# Altium project RadiationDetector.PrjPcb (part 4 of 5)

## Sheet Geiger_Circuit.SchDoc
size A4; CheckedBy: Sr. Andrés Roldán; Address1: Avda. Madrid 28, Edif. I+D Josefina Castro Vizoso,  2ª planta 18012 - GRANADA, SPAIN; SheetNumber: 6; SheetTotal: 6
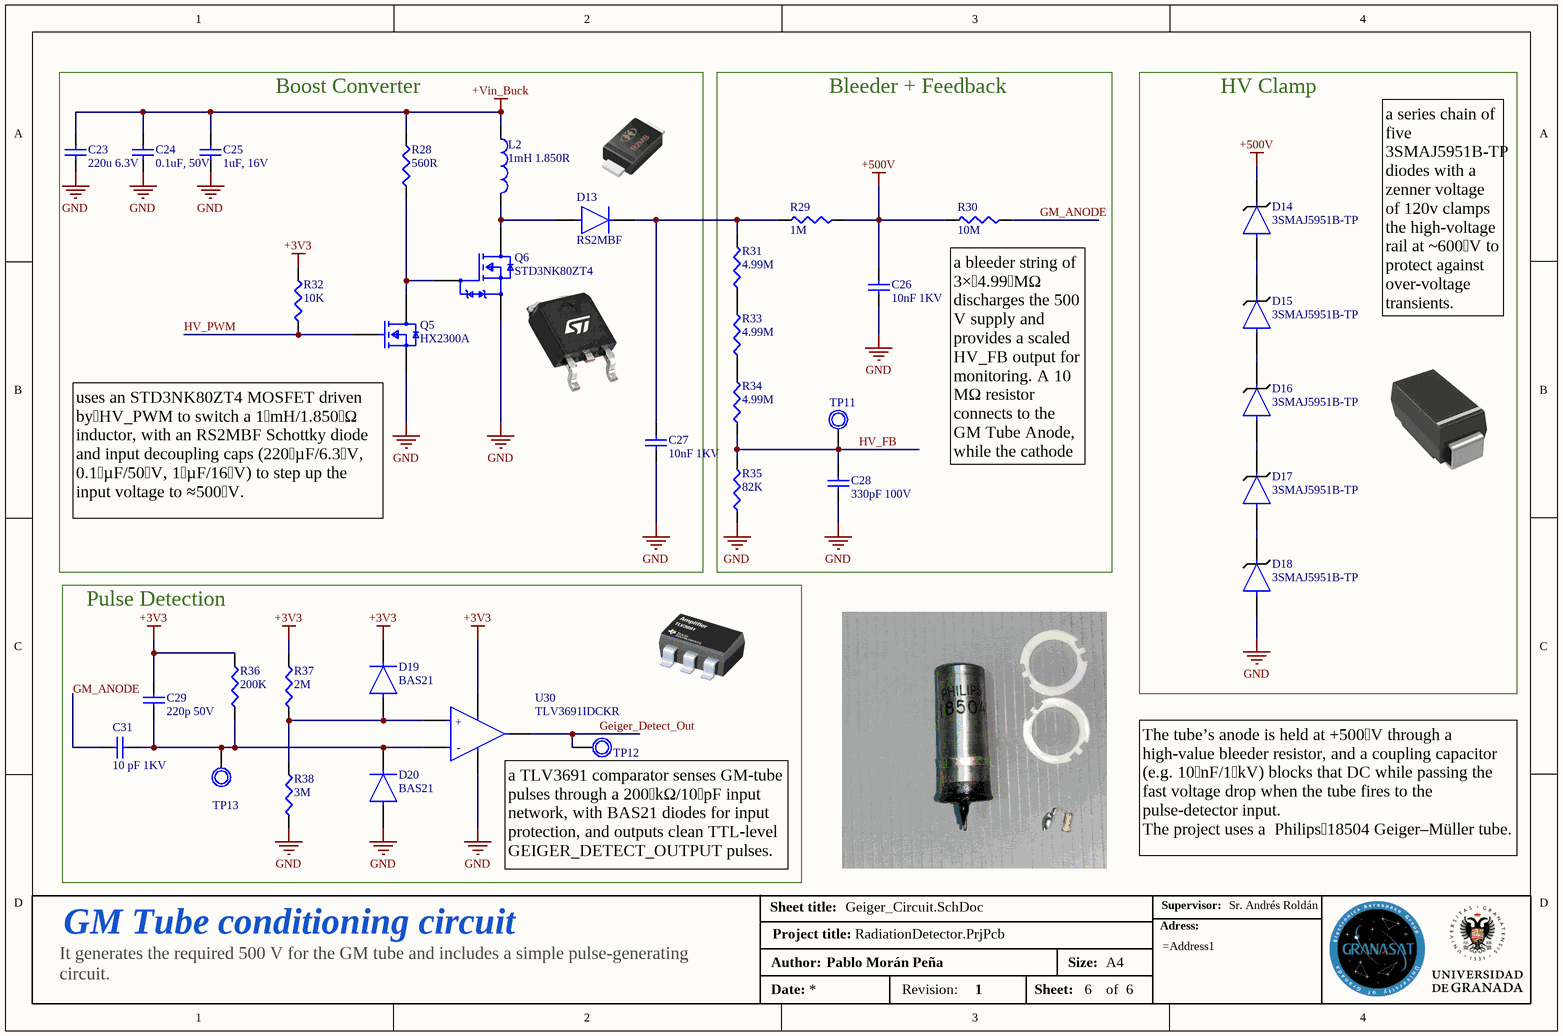
[diagram p5: Geiger_Circuit.SchDoc]

### Parts
C23  220u 6.3V  [ANTC3225X280N]
C24  0.1uF, 50V  [CAP 0402_1005]
C25  1uF, 16V  [CAP 0402_1005]
C26  10nF 1KV  [CAP 1206_3216 - 1.2MM]
C27  10nF 1KV  [CAP 1206_3216 - 1.2MM]
C28  330pF 100V  [CAPC2012X94N]
C29  220p 50V  [CAP 0402_1005]
C31  10 pF 1KV  [CAP 1206_3216 - 1.2MM]
D13  RS2MBF  [RS2MBF]
D14  3SMAJ5951B-TP  [DIOM4325X244N]
D15  3SMAJ5951B-TP  [DIOM4325X244N]
D16  3SMAJ5951B-TP  [DIOM4325X244N]
D17  3SMAJ5951B-TP  [DIOM4325X244N]
D18  3SMAJ5951B-TP  [DIOM4325X244N]
D19  BAS21  [SOT-23]
D20  BAS21  [SOT-23]
L2  1mH 1.850R  [48102SC]
Q5  HX2300A  [SOT-23]
Q6  STD3NK80ZT4  [DPAK_STM]
R28  560R  [RESC1005X37N]
R29  1M  [RESC1005X37N]
R30  10M  [RESC1005X37N]
R31  4.99M  [RESC3116X65N]
R32  10K  [RESC1005X37N]
R33  4.99M  [RESC3116X65N]
R34  4.99M  [RESC3116X65N]
R35  82K  [RESC1005X37N]
R36  200K  [RESC1005X37N]
R37  2M  [RESC1005X37N]
R38  3M  [RESC1005X37N]
TP11  Testpoint  [Testpoint]  (value not drawn)  (no BOM)
TP12  Testpoint  [Testpoint]  (value not drawn)  (no BOM)
TP13  Testpoint  [Testpoint]  (value not drawn)  (no BOM)
U30  TLV3691IDCKR  [FP-DCK0005A-IPC_B]

### Blocks framed on the sheet
Boost Converter: C23-C25 C27 D13 L2 Q5 Q6 R28 R32
Bleeder + Feedback: C26 C28 R29-R31 R33-R35 TP11
HV Clamp: D14-D18
Pulse Detection: C29 C31 D19 D20 R36-R38 TP12 TP13 U30

### Nets
+3V3: C29.2 D19.3(C) R32.2 R36.2 R37.1 U30.5(VCC)
+500V: C26.2 D14.1(C) R29.2 R30.1
+Vin_Buck: C23.2 C24.2 C25.2 L2.1 R28.2
GND: C23.1 C24.1 C25.1 C26.1 C27.1 C28.1 D18.2(A) D20.1(A) Q5.2(S) Q6.3(Source) R35.1 R38.1 U30.2(GND)
Geiger_Detect_Out: TP12.1 U30.4(OUT)
GM_ANODE: C31.1 R30.2
HV_FB: C28.2 R34.2 R35.2 TP11.1
HV_PWM: Q5.1(G) R32.1
NetC27_2: C27.2 D13.1(C) R29.1 R31.1
NetC29_1: C29.1 C31.2 D20.3(C) R36.1 TP13.1 U30.3(IN-)
NetD13_2: D13.2(A) L2.2 Q6.2(Drain)
NetD14_2: D14.2(A) D15.1(C)
NetD15_2: D15.2(A) D16.1(C)
NetD16_2: D16.2(A) D17.1(C)
NetD17_2: D17.2(A) D18.1(C)
NetD19_1: D19.1(A) R37.2 R38.2 U30.1(IN+)
NetQ5_3: Q5.3(D) Q6.1(Gate) R28.1
NetR31_2: R31.2 R33.1
NetR33_2: R33.2 R34.1

### Notes on the sheet
- a series chain of five 3SMAJ5951B-TP diodes with a zenner voltage of 120v clamps the high‑voltage rail at ~600 V to protect against over‑voltage transients.
- (near Q5) uses an STD3NK80ZT4 MOSFET driven by HV_PWM to switch a 1 mH/1.850 Ω inductor, with an RS2MBF Schottky diode and input decoupling caps (220 µF/6.3 V, 0.1 µF/50 V, 1 µF/16 V) to step up the input voltage to ≈500 V.
- (near R30) a bleeder string of 3× 4.99 MΩ discharges the 500 V supply and provides a scaled HV_FB output for monitoring. A 10 MΩ resistor connects to the GM Tube Anode, while the cathode is connected to GND
- The tube’s anode is held at +500 V through a high‑value bleeder resistor, and a coupling capacitor (e.g. 10 nF/1 kV) blocks that DC while passing the fast voltage drop when the tube fires to the pulse‑detector input.
  The project uses a  Philips 18504 Geiger–Müller tube.
- a TLV3691 comparator senses GM‑tube pulses through a 200 kΩ/10 pF input network, with BAS21 diodes for input protection, and outputs clean TTL‑level GEIGER_DETECT_OUTPUT pulses.
- Sheet title:
- Supervisor:
- GM Tube conditioning circuit
- Author:
- Project title:
- Size:
- A4
- Adress:
- It generates the required 500 V for the GM tube and includes a simple pulse-generating circuit.
- Date:
- Revision:
- Sheet:
- of
- (in symbol TLV3691IDCKR) +; -

### Library data of the parts
C23 = CL32A227MQVNNNE: CAP CER 220UF 6.3V X5R 1210; Manufacturer: Samsung; Dielectric Material: Ceramic; Multilayer: Yes; Tolerance  (fill in as +-): 20%; Supplier: Digikey; Supplier Part Number: 1276-3375-6-ND; Manufacturer Part Number: CL32A227MQVNNNE; RoHS: Yes; Category: Ceramic Capacitors; Stock: 100920; Pricing: 1=1,9, 10=1,278, 100=0,9548 (USD); Mounting Technology: Surface Mount; Pins: 2; Package Shape: Rectangular; Terminal Finish: Nickel; Case/Package: 1210; Min Operating Temperature: -55°C; Max Operating Temperature: 85°C; JESD-609 Code: e3; Package Style: SMTMeter; Value: 220uF; Capacitor Type: Ceramic; Packaging: Tape and Reel; Tolerance (fill in as +-): 20%; Rated DC Voltage (URdc): 6.3V; Temperature Characteristics Code: X5R; Termination: Wraparound; Length: 3.2mm; Width: 2.5mm; Height: 2.8mm; Reach SVHC Compliant: Yes; RoHS Compliant: Yes; ComponentLink1URL: https://datasheet.ciiva.com:443/pdfs/VipMasterIC/IC/SEMS/SEMS-S-A0008525088/SEMS-S-A0008525201-1.pdf?src-supplier=IHS+Markit; ComponentLink1Description: https://datasheet.ciiva.com:443/pdfs/VipMasterIC/IC/SEMS/SEMS-S-A0008525088/SEMS-S-A0008525201-1.pdf?src-supplier=IHS+Markit; ComponentLink2URL: https://datasheet.ciiva.com/25722/cl32a227mqvnnne-25722912.pdf?src-supplier=Digikey; ComponentLink2Description: https://datasheet.ciiva.com/25722/cl32a227mqvnnne-25722912.pdf?src-supplier=Digikey; LCSC Part Number: C400951
C24 = CL05B104KB5NNNC: CAP CER 0.1UF 50V X7R 0402; Manufacturer: Samsung; Dielectric Material: Ceramic; Value: 100nF; Multilayer: Yes; Tolerance  (fill in as +-): 10%; Supplier: Avnet; Supplier Part Number: CL05B104KB5NNNC; Manufacturer Part Number: CL05B104KB5NNNC; RoHS: Yes; Category: Ceramic Capacitors; Pricing: 100000=0,00598, 120000=0,00595, 220000=0,00592, 500000=0,00589, 1000000=0,00586 (USD); Mounting Technology: Surface Mount; Pins: 2; Package Shape: Rectangular; Case/Package: 0402; Terminal Finish: Nickel; Min Operating Temperature: -55°C; Max Operating Temperature: 125°C; JESD-609 Code: e3; Capacitor Type: Ceramic; Packaging: Tape and Reel; Tolerance (fill in as +-): 10%; Rated DC Voltage (URdc): 50V; Temperature Characteristics Code: X7R; Termination: Wraparound; Reach SVHC Compliant: Yes; RoHS Compliant: Yes; ComponentLink1URL: https://datasheet.ciiva.com:443/pdfs/VipMasterIC/IC/SEMS/SEMS-S-A0008523115/SEMS-S-A0008523176-1.pdf?src-supplier=IHS+Markit; ComponentLink1Description: https://datasheet.ciiva.com:443/pdfs/VipMasterIC/IC/SEMS/SEMS-S-A0008523115/SEMS-S-A0008523176-1.pdf?src-supplier=IHS+Markit; ComponentLink2URL: https://datasheet.octopart.com/CL05B104KB5NNNC-Samsung-datasheet-97040617.pdf?src-supplier=Future+Electronics; ComponentLink2Description: https://datasheet.octopart.com/CL05B104KB5NNNC-Samsung-datasheet-97040617.pdf?src-supplier=Future+Electronics; ComponentLink3URL: https://datasheet.octopart.com/CL05B104KB5NNNC-Samsung-datasheet-8326407.pdf?src-supplier=TME; ComponentLink3Description: https://datasheet.octopart.com/CL05B104KB5NNNC-Samsung-datasheet-8326407.pdf?src-supplier=TME; LCSC Part Number: C960916
C25 = CL05A105KO5NNNC: CAP CER 1UF 16V X5R 0402; Manufacturer: Samsung Electro-Mechanics; Dielectric Material: Ceramic; Multilayer: Yes; Tolerance  (fill in as +-): 10%; Supplier: Digikey; Supplier Part Number: 1276-1067-1-ND; Manufacturer Part Number: CL05A105KO5NNNC; Category: Ceramic Capacitors; Stock: 655135; Pricing: 1=0,08, 10=0,014, 100=0,0104, 1000=0,0072, 2500=0,0064 (USD); Mounting Technology: Surface Mount; Pins: 2; Package Shape: Rectangular; Case/Package: 0402; Terminal Finish: Nickel; Min Operating Temperature: -55°C; Max Operating Temperature: 85°C; JESD-609 Code: e3; Value: 1uF; Capacitor Type: Ceramic; Package Style: SMTMeter; Packaging: Tape and Reel; Tolerance (fill in as +-): 10%; Rated DC Voltage (URdc): 16V; Temperature Characteristics Code: X5R; Termination: Wraparound; Length: 1mm; Width: 0.5mm; Height: 0.55mm; Reach SVHC Compliant: Yes; RoHS Compliant: Yes; ComponentLink1URL: https://datasheet.ciiva.com:443/pdfs/VipMasterIC/IC/SEMS/SEMS-S-A0008384515/SEMS-S-A0008892675-1.pdf?src-supplier=IHS+Markit; ComponentLink1Description: https://datasheet.ciiva.com:443/pdfs/VipMasterIC/IC/SEMS/SEMS-S-A0008384515/SEMS-S-A0008892675-1.pdf?src-supplier=IHS+Markit; ComponentLink2URL: https://datasheet.octopart.com/CL05A105KO5NNNC-Samsung-Electro-Mechanics-datasheet-181960514.pdf?src-supplier=Farnell; ComponentLink2Description: https://datasheet.octopart.com/CL05A105KO5NNNC-Samsung-Electro-Mechanics-datasheet-181960514.pdf?src-supplier=Farnell; ComponentLink3URL: https://datasheet.octopart.com/CL05A105KO5NNNC-Samsung-Electro-Mechanics-datasheet-136031720.pdf?src-supplier=Samsung+SCT; ComponentLink3Description: https://datasheet.octopart.com/CL05A105KO5NNNC-Samsung-Electro-Mechanics-datasheet-136031720.pdf?src-supplier=Samsung+SCT; ComponentLink4URL: https://datasheet.octopart.com/CL05A105KO5NNNC-Samsung-Electro-Mechanics-datasheet-110226202.pdf?src-supplier=Future+Electronics; ComponentLink4Description: https://datasheet.octopart.com/CL05A105KO5NNNC-Samsung-Electro-Mechanics-datasheet-110226202.pdf?src-supplier=Future+Electronics; ComponentLink5URL: https://datasheet.octopart.com/CL05A105KO5NNNC-Samsung-Electro-Mechanics-datasheet-81461590.pdf?src-supplier=Future+Electronics; ComponentLink5Description: https://datasheet.octopart.com/CL05A105KO5NNNC-Samsung-Electro-Mechanics-datasheet-81461590.pdf?src-supplier=Future+Electronics; ComponentLink6URL: https://datasheet.octopart.com/CL05A105KO5NNNC-Samsung-Electro-Mechanics-datasheet-149136633.pdf?src-supplier=Future+Electronics; ComponentLink6Description: https://datasheet.octopart.com/CL05A105KO5NNNC-Samsung-Electro-Mechanics-datasheet-149136633.pdf?src-supplier=Future+Electronics; ComponentLink7URL: https://datasheet.octopart.com/CL05A105KO5NNNC-Samsung-Electro-Mechanics-datasheet-97040617.pdf; ComponentLink7Description: https://datasheet.octopart.com/CL05A105KO5NNNC-Samsung-Electro-Mechanics-datasheet-97040617.pdf; ComponentLink8URL: https://datasheet.octopart.com/CL05A105KO5NNNC-Samsung-Electro-Mechanics-datasheet-8324245.pdf; ComponentLink8Description: https://datasheet.octopart.com/CL05A105KO5NNNC-Samsung-Electro-Mechanics-datasheet-8324245.pdf; ComponentLink9URL: https://datasheet.octopart.com/General-Multilayer-Ceramic-Capacitors-Samsung-datasheet-family-111.pdf; ComponentLink9Description: https://datasheet.octopart.com/General-Multilayer-Ceramic-Capacitors-Samsung-datasheet-family-111.pdf; ComponentLink10URL: https://datasheet.octopart.com/CL05A105KO5NNNC-Samsung-Electro-Mechanics-datasheet-11776774.pdf?src-supplier=Arrow+Electronics; ComponentLink10Description: https://datasheet.octopart.com/CL05A105KO5NNNC-Samsung-Electro-Mechanics-datasheet-11776774.pdf?src-supplier=Arrow+Electronics; ComponentLink11URL: https://datasheet.octopart.com/CL05A105KO5NNNC-Samsung-datasheet-97040617.pdf; ComponentLink11Description: https://datasheet.octopart.com/CL05A105KO5NNNC-Samsung-datasheet-97040617.pdf; ComponentLink12URL: https://datasheet.octopart.com/CL05A105KO5NNNC-Samsung-datasheet-8324245.pdf; ComponentLink12Description: https://datasheet.octopart.com/CL05A105KO5NNNC-Samsung-datasheet-8324245.pdf; ComponentLink13URL: https://datasheet.octopart.com/CL05A105KO5NNNC-Samsung-datasheet-42280519.pdf?src-supplier=Future+Electronics; ComponentLink13Description: https://datasheet.octopart.com/CL05A105KO5NNNC-Samsung-datasheet-42280519.pdf?src-supplier=Future+Electronics; ComponentLink14URL: https://datasheet.octopart.com/CL05A105KO5NNNC-Samsung-datasheet-34152987.pdf?src-supplier=Future+Electronics; ComponentLink14Description: https://datasheet.octopart.com/CL05A105KO5NNNC-Samsung-datasheet-34152987.pdf?src-supplier=Future+Electronics; ComponentLink15URL: https://datasheet.octopart.com/CL05A105KO5NNNC-Samsung-datasheet-11776774.pdf?src-supplier=Future+Electronics; ComponentLink15Description: https://datasheet.octopart.com/CL05A105KO5NNNC-Samsung-datasheet-11776774.pdf?src-supplier=Future+Electronics; ComponentLink16URL: https://datasheet.octopart.com/CL05A105KO5NNNC-Samsung-datasheet-8329584.pdf?src-supplier=Future+Electronics; ComponentLink16Description: https://datasheet.octopart.com/CL05A105KO5NNNC-Samsung-datasheet-8329584.pdf?src-supplier=Future+Electronics; ComponentLink17URL: https://datasheet.octopart.com/CL05A105KO5NNNC-Samsung-datasheet-59220082.pdf?src-supplier=TME; ComponentLink17Description: https://datasheet.octopart.com/CL05A105KO5NNNC-Samsung-datasheet-59220082.pdf?src-supplier=TME; LCSC Part Number: C29266
C26 C27 = CC1206KKX7RCBB103: CAP CER 10000PF 1KV X7R 1206; Manufacturer: Yageo; Dielectric Material: Ceramic; Multilayer: Yes; Tolerance  (fill in as +-): 10%; Supplier: Digikey; Supplier Part Number: 311-1500-1-ND; Manufacturer Part Number: CC1206KKX7RCBB103; RoHS: Yes; Category: Ceramic Capacitors; Stock: 52303; Pricing: 1=0,54, 10=0,329, 100=0,2222, 1000=0,16703 (USD); Mounting Technology: Surface Mount; Pins: 2; Package Shape: Rectangular; Case/Package: 1206; Terminal Finish: Nickel; Min Operating Temperature: -55°C; Max Operating Temperature: 125°C; JESD-609 Code: e3; Value: 10nF; Capacitor Type: Ceramic; Package Style: SMTMeter; Packaging: Tape and Reel; Tolerance (fill in as +-): 10%; Rated DC Voltage (URdc): 1kV; Temperature Characteristics Code: X7R; Termination: Wraparound; Length: 3.2mm; Width: 1.6mm; Height: 1.25mm; Reach SVHC Compliant: Yes; RoHS Compliant: Yes; ComponentLink1URL: https://datasheet.ciiva.com:443/pdfs/VipMasterIC/IC/YAGO/YAGO-S-A0000113014/YAGO-S-A0000113014-1.pdf?src-supplier=IHS+Markit; ComponentLink1Description: https://datasheet.ciiva.com:443/pdfs/VipMasterIC/IC/YAGO/YAGO-S-A0000113014/YAGO-S-A0000113014-1.pdf?src-supplier=IHS+Markit; ComponentLink2URL: https://datasheet.ciiva.com/11788/0900766b80d8503a-11788379.pdf?src-supplier=Rs; ComponentLink2Description: https://datasheet.ciiva.com/11788/0900766b80d8503a-11788379.pdf?src-supplier=Rs; ComponentLink3URL: https://datasheet.ciiva.com/26863/getdatasheetpartid-403810-26863103.pdf?src-supplier=Verical; ComponentLink3Description: https://datasheet.ciiva.com/26863/getdatasheetpartid-403810-26863103.pdf?src-supplier=Verical; ComponentLink4URL: https://datasheet.ciiva.com/15381/upy-gp-np0-16v-to-50v-8-15381925.pdf?src-supplier=Mouser; ComponentLink4Description: https://datasheet.ciiva.com/15381/upy-gp-np0-16v-to-50v-8-15381925.pdf?src-supplier=Mouser; LCSC Part Number: C107192
C28 = CC0805JRNPO0BN331: CAP CER 330PF 100V C0G/NPO 0805; Manufacturer: Yageo; Dielectric Material: Ceramic; Multilayer: Yes; Tolerance  (fill in as +-): 5%; Temperature Characteristics Code: C0G; Supplier: Digikey; Supplier Part Number: 311-3287-1-ND; Manufacturer Part Number: CC0805JRNPO0BN331; RoHS: Yes; Category: Ceramic Capacitors; Stock: 1000; Pricing: 1=0,13, 10=0,071, 100=0,0428, 1000=0,02846 (USD); Mounting Technology: Surface Mount; Pins: 2; Package Shape: Rectangular; Case/Package: 0805; Terminal Finish: Nickel; Min Operating Temperature: -55°C; Max Operating Temperature: 125°C; JESD-609 Code: e3; Value: 330pF; Capacitor Type: Ceramic; Package Style: SMTMeter; Packaging: Tape and Reel; Tolerance (fill in as +-): 5%; Rated DC Voltage (URdc): 100V; Termination: Wraparound; Length: 2mm; Width: 1.25mm; Height: 0.6mm; RoHS Compliant: Yes; Reach SVHC Compliant: Yes; ComponentLink1URL: https://datasheet.ciiva.com:443/pdfs/VipMasterIC/IC/YAGO/YAGO-S-A0003556389/YAGO-S-A0003556389-1.pdf?src-supplier=IHS+Markit; ComponentLink1Description: https://datasheet.ciiva.com:443/pdfs/VipMasterIC/IC/YAGO/YAGO-S-A0003556389/YAGO-S-A0003556389-1.pdf?src-supplier=IHS+Markit; ComponentLink2URL: https://datasheet.ciiva.com/26862/getdatasheetpartid-486993-26862927.pdf?src-supplier=Verical; ComponentLink2Description: https://datasheet.ciiva.com/26862/getdatasheetpartid-486993-26862927.pdf?src-supplier=Verical; ComponentLink3URL: https://datasheet.ciiva.com/177/mlccorderingcode-177835.pdf?src-supplier=Digikey; ComponentLink3Description: https://datasheet.ciiva.com/177/mlccorderingcode-177835.pdf?src-supplier=Digikey; ComponentLink4URL: https://datasheet.ciiva.com/11586/upy-np0x7r-mv-100-to-630v-9-11586191.pdf?src-supplier=Avnet; ComponentLink4Description: https://datasheet.ciiva.com/11586/upy-np0x7r-mv-100-to-630v-9-11586191.pdf?src-supplier=Avnet; ComponentLink5URL: https://datasheet.ciiva.com/17206/upy-np0x7r-mv-100-to-630v-9-17206229.pdf?src-supplier=Future+Electronics; ComponentLink5Description: https://datasheet.ciiva.com/17206/upy-np0x7r-mv-100-to-630v-9-17206229.pdf?src-supplier=Future+Electronics; LCSC Part Number: C113820
C29 = CL05B221KB5NNNC: CAP CER 220PF 50V X7R 0402; Manufacturer: Samsung; Dielectric Material: Ceramic; Multilayer: Yes; Tolerance  (fill in as +-): 10%; Supplier: Digikey; Supplier Part Number: 1276-1531-1-ND; Manufacturer Part Number: CL05B221KB5NNNC; RoHS: Yes; Category: Ceramic Capacitors; Stock: 59270; Pricing: 1=0,1, 10=0,019, 100=0,0104, 1000=0,00621, 2500=0,00466, 5000=0,00442 (USD); Mounting Technology: Surface Mount; Pins: 2; Package Shape: Rectangular; Case/Package: 0402; Terminal Finish: Nickel; Min Operating Temperature: -55°C; Max Operating Temperature: 125°C; JESD-609 Code: e3; Value: 220pF; Capacitor Type: Ceramic; Package Style: SMTMeter; Packaging: Tape and Reel; Tolerance (fill in as +-): 10%; Rated DC Voltage (URdc): 50V; Temperature Characteristics Code: X7R; Termination: Wraparound; Length: 1mm; Width: 0.5mm; Height: 0.55mm; Reach SVHC Compliant: Yes; RoHS Compliant: Yes; ComponentLink1URL: https://datasheet.ciiva.com:443/pdfs/VipMasterIC/IC/SEMS/SEMS-S-A0008384515/SEMS-S-A0008872887-1.pdf?src-supplier=IHS+Markit; ComponentLink1Description: https://datasheet.ciiva.com:443/pdfs/VipMasterIC/IC/SEMS/SEMS-S-A0008384515/SEMS-S-A0008872887-1.pdf?src-supplier=IHS+Markit; ComponentLink2URL: https://datasheet.ciiva.com/25806/cl05b221kb5nnnc-25806724.pdf?src-supplier=Digikey; ComponentLink2Description: https://datasheet.ciiva.com/25806/cl05b221kb5nnnc-25806724.pdf?src-supplier=Digikey; ComponentLink3URL: https://datasheet.ciiva.com/26838/getdatasheetpartid-359684-26838219.pdf?src-supplier=Verical; ComponentLink3Description: https://datasheet.ciiva.com/26838/getdatasheetpartid-359684-26838219.pdf?src-supplier=Verical; ComponentLink4URL: https://datasheet.ciiva.com/16449/cl05b221kb5nnnc-16449133.pdf?src-supplier=Future+Electronics; ComponentLink4Description: https://datasheet.ciiva.com/16449/cl05b221kb5nnnc-16449133.pdf?src-supplier=Future+Electronics; ComponentLink5URL: https://datasheet.ciiva.com/26309/mlcc-catalogdownload2013-eng-26309018.pdf?src-supplier=Distrelec; ComponentLink5Description: https://datasheet.ciiva.com/26309/mlcc-catalogdownload2013-eng-26309018.pdf?src-supplier=Distrelec; LCSC Part Number: C296710
C31 = CC1206JKNPOCBN100: CAP CER 10PF 1KV C0G/NPO 1206; Manufacturer: Yageo; Dielectric Material: Ceramic; Multilayer: Yes; Tolerance  (fill in as +-): 5%; Temperature Characteristics Code: NP0; Supplier: Digikey; Supplier Part Number: 311-1912-6-ND; Manufacturer Part Number: CC1206JKNPOCBN100; RoHS: Yes; Category: Ceramic Capacitors; Stock: 6057; Pricing: 1=0,22, 10=0,129, 100=0,0815, 1000=0,05691 (USD); Pins: 2; Case/Package: 1206; Terminal Finish: Nickel; Min Operating Temperature: -55°C; Max Operating Temperature: 125°C; JESD-609 Code: e3; Value: 10pF; Capacitor Type: Ceramic; Package Style: SMTMeter; Packaging: Tape and Reel; Tolerance (fill in as +-): 5%; Rated DC Voltage (URdc): 1kV; Series: SIZE(HIGH-VOLTAGE); Length: 3.2mm; Width: 1.6mm; Height: 1.25mm; Reach SVHC Compliant: Yes; RoHS Compliant: Yes; ComponentLink1URL: https://datasheet.ciiva.com:443/pdfs/VipMasterIC/IC/YAGO/YAGO-S-A0000113014/YAGO-S-A0000113014-1.pdf?src-supplier=IHS+Markit; ComponentLink1Description: https://datasheet.ciiva.com:443/pdfs/VipMasterIC/IC/YAGO/YAGO-S-A0000113014/YAGO-S-A0000113014-1.pdf?src-supplier=IHS+Markit; ComponentLink2URL: https://datasheet.ciiva.com/11494/hv-11494856.pdf?src-supplier=Avnet; ComponentLink2Description: https://datasheet.ciiva.com/11494/hv-11494856.pdf?src-supplier=Avnet; LCSC Part Number: C107172
D13 = RS2MBF: 2A 1000V 1.3V SMB-FL Diodes - General Purpose ROHS; LCSC Part Number: C5271853
D14-D18 = 3SMAJ5951B-TP: DIODE ZENER 120V 3W DO214AC; Manufacturer: MCC; Diode Element Material: SILICON; Package Body Material: Plastic; Polarity: Unidirectional; Dynamic Impedance-Max: 380R; Number of Elements: 1; Time @ Peak Reflow Temperature-Max (s): 10s; Voltage Tol-Max: 5%; Test Current: 3.1mA; JEDEC-95 Code: DO-214AC; Supplier: Digikey; Supplier Part Number: 3SMAJ5951B-TPMSCT-ND; Manufacturer Part Number: 3SMAJ5951B-TP; RoHS: Yes; Category: Zener Diodes; Stock: 10918; Pricing: 1=0,42, 10=0,259, 100=0,1637, 500=0,12212, 1000=0,098, 2000=0,09734 (USD); Pins: 2; Package Shape: Rectangular; Terminal Finish: Tin; Min Operating Temperature: -55°C; Max Operating Temperature: 150°C; JESD-609 Code: e3; Diode Type: ZENER; JESD-30 Code: R-PDSO-C2; Moisture Sensitivity Level: 1; Package Style: SMALL OUTLINEMeter; Peak Reflow Temperature (Cel): 260°C; Max Power Dissipation: 3W; Reference Voltage-Nom: 120V; Surface Mount: Yes; Technology: ZENER; Terminal Form: C BEND; Terminal Position: DUAL; Reach SVHC Compliant: No; RoHS Compliant: Yes; ComponentLink1URL: https://datasheet.ciiva.com:443/pdfs/VipMasterIC/IC/MCCC/MCCC-S-A0009752199/MCCC-S-A0009752199-1.pdf?src-supplier=IHS+Markit; ComponentLink1Description: https://datasheet.ciiva.com:443/pdfs/VipMasterIC/IC/MCCC/MCCC-S-A0009752199/MCCC-S-A0009752199-1.pdf?src-supplier=IHS+Markit; ComponentLink2URL: https://datasheet.ciiva.com/6389/3smaj5913b3smaj5956bdo-214ac-6389957.pdf?src-supplier=Digikey; ComponentLink2Description: https://datasheet.ciiva.com/6389/3smaj5913b3smaj5956bdo-214ac-6389957.pdf?src-supplier=Digikey; LCSC Part Number: C511105
D19 D20 = BAS21: DIODE STANDARD 250V 200MA SOT233; Manufacturer: onsemi; Diode Type: RECTIFIER; Forward Voltage: 1V; Number of Elements: 1; Rep Pk Reverse Voltage-Max: 200V; Reverse Recovery Time-Max: 0.05us; Supplier: Farnell; Supplier Part Number: 9843728; Manufacturer Part Number: BAS21; RoHS: Yes; Pricing: 5=0,185, 25=0,136, 100=0,0803, 250=0,0677, 500=0,0551, 1000=0,0425, 5000=0,023 (GBP); Terminal Finish: Tin; Max Operating Temperature: 175°C; JESD-609 Code: e0; Max Output current: 200mA; Surface Mount: Yes; RoHS Compliant: No; ComponentLink1URL: https://datasheet.ciiva.com/1179/82312-1179824.pdf?src-supplier=Element14; ComponentLink1Description: https://datasheet.ciiva.com/1179/82312-1179824.pdf?src-supplier=Element14; ComponentLink2URL: https://datasheet.ciiva.com/1179/82312-1179825.pdf?src-supplier=Element14; ComponentLink2Description: https://datasheet.ciiva.com/1179/82312-1179825.pdf?src-supplier=Element14; LCSC Part Number: C8661
L2 = 48102SC: FIXED IND 1MH 520MA 1.85 OHM SMD; Manufacturer: Murata; Tolerance: 20%; DC Resistance (DCR): 1.85R; Inductance-Nom (L): 1000uH; Inductor Application: POWER INDUCTOR; Inductor Type: GENERAL PURPOSE INDUCTOR; Channels: 1; Self Resonant Frequency: 4MHz; Shape/Size Description: RECTANGULAR PACKAGE; Shielding: Shielded; Test Frequency: 10kHz; Supplier: Digikey; Supplier Part Number: 811-3598-1-ND; Manufacturer Part Number: 48102SC; RoHS: Yes; Category: Fixed Inductors; Stock: 1140; Pricing: 1=0,52 (USD); Pins: 2; Terminal Finish: Tin; Min Operating Temperature: -40°C; Max Operating Temperature: 85°C; JESD-609 Code: e3; Surface Mount: Yes; Terminal Placement: Dual Ended; Termination: One Surface; Reach SVHC Compliant: Yes; RoHS Compliant: Yes; ComponentLink1URL: https://datasheet.ciiva.com:443/pdfs/VipMasterIC/IC/MUPS/MUPS-S-A0002835574/MUPS-S-A0002835574-1.pdf?src-supplier=IHS+Markit; ComponentLink1Description: https://datasheet.ciiva.com:443/pdfs/VipMasterIC/IC/MUPS/MUPS-S-A0002835574/MUPS-S-A0002835574-1.pdf?src-supplier=IHS+Markit; ComponentLink2URL: https://datasheet.ciiva.com/8510/kmp-4800s-8510640.pdf?src-supplier=Avnet; ComponentLink2Description: https://datasheet.ciiva.com/8510/kmp-4800s-8510640.pdf?src-supplier=Avnet; LCSC Part Number: C5223670
Q5 = HX2300A: 20V 2.5A 46mΩ@4.5V,2.5A 650mV 1 N-channel SOT-23 MOSFETs ROHS; LCSC Part Number: C296302
Q6 = STD3NK80ZT4: MOSFET N-CH 800V 2.5A DPAK; Manufacturer: STMicroelectronics; Package Body Material: Plastic; Transistor Element Material: SILICON; Polarity/Channel Type: N-CHANNEL; Avalanche Energy Rating (Eas): 170mJ; Drain-source On Resistance-Max: 4.5R; FET Technology: METAL-OXIDE SEMICONDUCTOR; Number of Elements: 1; Operating Mode: ENHANCEMENT MODE; Power Dissipation-Max (Abs): 70W; Pulsed Drain Current-Max (IDM): 10A; Transistor Application: SWITCHING; JEDEC-95 Code: TO-252; Qualification Status: Not Qualified; Supplier: Digikey; Supplier Part Number: 497-7968-1-ND; Manufacturer Part Number: STD3NK80ZT4; RoHS: Yes; Category: MOSFETs; Stock: 5628; Pricing: 1=2,08, 10=1,336, 100=1,0404, 500=0,83494, 1000=0,81702 (USD); Pins: 2; Package Shape: Rectangular; Terminal Finish: Tin; Max Operating Temperature: 150°C; JESD-609 Code: e3; Drain Current-Max (Abs) (ID): 2.5A; Drain Current-Max (ID): 2.5A; DS Breakdown Voltage-Min: 800V; JESD-30 Code: R-PSSO-G2; Moisture Sensitivity Level: 1; Package Style: SMALL OUTLINEMeter; Peak Reflow Temperature (Cel): 260°C; Surface Mount: Yes; Terminal Form: Gull Wing; Terminal Position: SINGLE; RoHS Compliant: Yes; Reach SVHC Compliant: No; ComponentLink1URL: https://datasheet.ciiva.com:443/pdfs/VipMasterIC/IC/SGST/SGST-S-A0003061510/SGST-S-A0003061510-1.pdf?src-supplier=IHS+Markit; ComponentLink1Description: https://datasheet.ciiva.com:443/pdfs/VipMasterIC/IC/SGST/SGST-S-A0003061510/SGST-S-A0003061510-1.pdf?src-supplier=IHS+Markit; ComponentLink2URL: https://datasheet.ciiva.com/6380/cd00003377-6380362.pdf?src-supplier=Digikey; ComponentLink2Description: https://datasheet.ciiva.com/6380/cd00003377-6380362.pdf?src-supplier=Digikey; ComponentLink3URL: https://datasheet.ciiva.com/6380/cd00003377-6380363.pdf?src-supplier=Digikey; ComponentLink3Description: https://datasheet.ciiva.com/6380/cd00003377-6380363.pdf?src-supplier=Digikey; ComponentLink4URL: https://datasheet.ciiva.com/6380/cd00003377-6380364.pdf?src-supplier=Digikey; ComponentLink4Description: https://datasheet.ciiva.com/6380/cd00003377-6380364.pdf?src-supplier=Digikey; ComponentLink5URL: https://datasheet.ciiva.com/16220/cd00003377-16220246.pdf?src-supplier=Future+Electronics; ComponentLink5Description: https://datasheet.ciiva.com/16220/cd00003377-16220246.pdf?src-supplier=Future+Electronics; ComponentLink6URL: https://datasheet.ciiva.com/8025/1689953-8025081.pdf?src-supplier=Element14; ComponentLink6Description: https://datasheet.ciiva.com/8025/1689953-8025081.pdf?src-supplier=Element14; LCSC Part Number: C411398
R28 = AC0402FR-07560RL: RES SMD 560 OHM 1% 1/16W 0402; Manufacturer: Yageo; Additional Feature: LASER TRIMMABLE; Power: 62.5mW; Rated Temperature: 70°C; Working Voltage: 50V; Temperature Coefficient (ppm/Cel): 100; Package Height: 0.32mm; Package Length: 1mm; Package Width: 0.5mm; Reference Standard: AEC-Q200; Supplier: Digikey; Supplier Part Number: 13-AC0402FR-07560RLCT-ND; Manufacturer Part Number: AC0402FR-07560RL; RoHS: Yes; Category: Chip SMD Resistors; Stock: 15456; Pricing: 1=0,1, 10=0,008, 100=0,0041, 1000=0,00357, 2500=0,00306 (USD); Mounting Technology: Surface Mount; Pins: 2; Package Shape: Rectangular; Case/Package: 0402; Terminal Finish: Nickel; Min Operating Temperature: -55°C; Max Operating Temperature: 155°C; Tolerance: 1%; JESD-609 Code: e3; Resistor Type: FIXED RESISTOR; Construction: Chip; Packaging: Tape and Reel; Value: 560R; Technology: METAL GLAZE/THICK FILM; Termination: Wraparound; Reach SVHC Compliant: Yes; RoHS Compliant: Yes; ComponentLink1URL: https://datasheet.ciiva.com:443/pdfs/VipMasterIC/IC/YAGO/YAGO-S-A0003597364/YAGO-S-A0003597364-1.pdf?src-supplier=IHS+Markit; ComponentLink1Description: https://datasheet.ciiva.com:443/pdfs/VipMasterIC/IC/YAGO/YAGO-S-A0003597364/YAGO-S-A0003597364-1.pdf?src-supplier=IHS+Markit; ComponentLink2URL: http://www.mouser.com/ds/2/447/yageodocoutput-1111992.pdf?src-supplier=Mouser; ComponentLink2Description: http://www.mouser.com/ds/2/447/yageodocoutput-1111992.pdf?src-supplier=Mouser; ComponentLink3URL: https://datasheet.octopart.com/AC0402FR-07560RL-Yageo-datasheet-151884373.pdf?src-supplier=Future+Electronics; ComponentLink3Description: https://datasheet.octopart.com/AC0402FR-07560RL-Yageo-datasheet-151884373.pdf?src-supplier=Future+Electronics; ComponentLink4URL: http://www.yageo.com/documents/recent/PYu-AC_51_RoHS_L_2_revised.pdf?src-supplier=Future+Electronics; ComponentLink4Description: http://www.yageo.com/documents/recent/PYu-AC_51_RoHS_L_2_revised.pdf?src-supplier=Future+Electronics; ComponentLink5URL: http://www.yageo.com/NewPortal/yageodocoutput?fileName=/pdf/R-Chip/PYu-AC_51_RoHS_L_6.pdf&src-supplier=Digikey; ComponentLink5Description: http://www.yageo.com/NewPortal/yageodocoutput?fileName=/pdf/R-Chip/PYu-AC_51_RoHS_L_6.pdf&src-supplier=Digikey; ComponentLink6URL: https://datasheet.octopart.com/AC0402FR-07560RL-Yageo-datasheet-178509465.pdf?src-supplier=Newark; ComponentLink6Description: https://datasheet.octopart.com/AC0402FR-07560RL-Yageo-datasheet-178509465.pdf?src-supplier=Newark; LCSC Part Number: C144747
R29 = AC0402FR-071ML: RES SMD 1M OHM 1% 1/16W 0402; Manufacturer: Yageo; Additional Feature: LASER TRIMMABLE; Power: 62.5mW; Rated Temperature: 70°C; Value: 1MR; Working Voltage: 50V; Temperature Coefficient (ppm/Cel): 100; Package Height: 0.32mm; Package Length: 1mm; Package Width: 0.5mm; Reference Standard: AEC-Q200; Supplier: Digikey; Supplier Part Number: YAG3450CT-ND; Manufacturer Part Number: AC0402FR-071ML; RoHS: Yes; Category: Chip SMD Resistors; Stock: 95082; Pricing: 1=0,1, 10=0,009, 100=0,0071, 1000=0,00612, 2500=0,0051, 5000=0,00407 (USD); Mounting Technology: Surface Mount; Pins: 2; Package Shape: Rectangular; Case/Package: 0402; Terminal Finish: Nickel; Min Operating Temperature: -55°C; Max Operating Temperature: 155°C; Tolerance: 1%; JESD-609 Code: e3; Resistor Type: FIXED RESISTOR; Construction: Chip; Packaging: Tape and Reel; Technology: METAL GLAZE/THICK FILM; Termination: Wraparound; Reach SVHC Compliant: Yes; RoHS Compliant: Yes; ComponentLink1URL: https://datasheet.ciiva.com:443/pdfs/VipMasterIC/IC/YAGO/YAGO-S-A0003597364/YAGO-S-A0003597364-1.pdf?src-supplier=IHS+Markit; ComponentLink1Description: https://datasheet.ciiva.com:443/pdfs/VipMasterIC/IC/YAGO/YAGO-S-A0003597364/YAGO-S-A0003597364-1.pdf?src-supplier=IHS+Markit; ComponentLink2URL: http://www.yageo.com/documents/recent/PYu-AC_51_RoHS_L_2.pdf?src-supplier=Mouser; ComponentLink2Description: http://www.yageo.com/documents/recent/PYu-AC_51_RoHS_L_2.pdf?src-supplier=Mouser; ComponentLink3URL: http://www.yageo.com/NewPortal/yageodocoutput?fileName=/pdf/R-Chip/PYu-AC_51_RoHS_L_6.pdf&src-supplier=Digikey; ComponentLink3Description: http://www.yageo.com/NewPortal/yageodocoutput?fileName=/pdf/R-Chip/PYu-AC_51_RoHS_L_6.pdf&src-supplier=Digikey; ComponentLink4URL: http://www.yageo.com/documents/recent/PYu-AC_51_RoHS_L_2_revised.pdf?src-supplier=Future+Electronics; ComponentLink4Description: http://www.yageo.com/documents/recent/PYu-AC_51_RoHS_L_2_revised.pdf?src-supplier=Future+Electronics; LCSC Part Number: C144787
R30 = AC0402FR-0710ML: RES SMD 10M OHM 1% 1/16W 0402; Manufacturer: Yageo; Additional Feature: LASER TRIMMABLE; Power: 62.5mW; Rated Temperature: 70°C; Value: 10MR; Working Voltage: 50V; Temperature Coefficient (ppm/Cel): 100; Package Height: 0.32mm; Package Length: 1mm; Package Width: 0.5mm; Reference Standard: AEC-Q200; Supplier: Digikey; Supplier Part Number: YAG3437CT-ND; Manufacturer Part Number: AC0402FR-0710ML; RoHS: Yes; Category: Chip SMD Resistors; Stock: 52815; Pricing: 1=0,1, 10=0,009, 100=0,0071, 1000=0,0051, 2500=0,00407 (USD); Mounting Technology: Surface Mount; Pins: 2; Package Shape: Rectangular; Case/Package: 0402; Terminal Finish: Nickel; Min Operating Temperature: -55°C; Max Operating Temperature: 155°C; Tolerance: 1%; JESD-609 Code: e3; Resistor Type: FIXED RESISTOR; Construction: Chip; Packaging: Tape and Reel; Technology: METAL GLAZE/THICK FILM; Termination: Wraparound; Reach SVHC Compliant: Yes; RoHS Compliant: Yes; ComponentLink1URL: https://datasheet.ciiva.com:443/pdfs/VipMasterIC/IC/YAGO/YAGO-S-A0003597364/YAGO-S-A0003597364-1.pdf?src-supplier=IHS+Markit; ComponentLink1Description: https://datasheet.ciiva.com:443/pdfs/VipMasterIC/IC/YAGO/YAGO-S-A0003597364/YAGO-S-A0003597364-1.pdf?src-supplier=IHS+Markit; ComponentLink2URL: https://datasheet.octopart.com/AC0402FR-0710ML-Yageo-datasheet-166720450.pdf?src-supplier=Future+Electronics; ComponentLink2Description: https://datasheet.octopart.com/AC0402FR-0710ML-Yageo-datasheet-166720450.pdf?src-supplier=Future+Electronics; ComponentLink3URL: http://www.yageo.com/NewPortal/yageodocoutput?fileName=/pdf/R-Chip/PYu-AC_51_RoHS_L_6.pdf&src-supplier=Digikey; ComponentLink3Description: http://www.yageo.com/NewPortal/yageodocoutput?fileName=/pdf/R-Chip/PYu-AC_51_RoHS_L_6.pdf&src-supplier=Digikey; ComponentLink4URL: https://datasheet.octopart.com/AC0402FR-0710ML-Yageo-datasheet-178509465.pdf?src-supplier=Farnell; ComponentLink4Description: https://datasheet.octopart.com/AC0402FR-0710ML-Yageo-datasheet-178509465.pdf?src-supplier=Farnell; ComponentLink5URL: https://datasheet.octopart.com/AC0402FR-0710ML-Yageo-datasheet-178509465.pdf?src-supplier=Newark; ComponentLink5Description: https://datasheet.octopart.com/AC0402FR-0710ML-Yageo-datasheet-178509465.pdf?src-supplier=Newark; ComponentLink6URL: https://datasheet.octopart.com/AC0402FR-0710ML-Yageo-datasheet-178509465.pdf?src-supplier=Element14; ComponentLink6Description: https://datasheet.octopart.com/AC0402FR-0710ML-Yageo-datasheet-178509465.pdf?src-supplier=Element14; LCSC Part Number: C144806
R31 R33 R34 = RC1206FR-074M99L: RES 4.99M OHM 1% 1/4W 1206; Manufacturer: Yageo; Additional Feature: LASER TRIMMABLE; Power: 250mW; Rated Temperature: 70°C; Value: 4.99MR; Working Voltage: 200V; Temperature Coefficient (ppm/Cel): 100; Package Height: 0.55mm; Package Length: 3.1mm; Package Width: 1.6mm; Supplier: Digikey; Supplier Part Number: 311-4.99MFRDKR-ND; Manufacturer Part Number: RC1206FR-074M99L; RoHS: Yes; Category: Chip SMD Resistors; Pricing: 1=0,1, 10=0,02, 100=0,0153, 1000=0,01224, 2500=0,01059 (USD); Mounting Technology: Surface Mount; Pins: 2; Package Shape: Rectangular; Case/Package: 1206; Terminal Finish: Nickel; Min Operating Temperature: -55°C; Max Operating Temperature: 155°C; Tolerance: 1%; JESD-609 Code: e3; Resistor Type: FIXED RESISTOR; Construction: Chip; Packaging: Tape and Reel; Technology: METAL GLAZE/THICK FILM; Termination: Wraparound; Reach SVHC Compliant: Yes; RoHS Compliant: Yes; ComponentLink1URL: https://datasheet.ciiva.com:443/pdfs/VipMasterIC/IC/YAGO/YAGO-S-A0008145938/YAGO-S-A0008145938-1.pdf?src-supplier=IHS+Markit; ComponentLink1Description: https://datasheet.ciiva.com:443/pdfs/VipMasterIC/IC/YAGO/YAGO-S-A0008145938/YAGO-S-A0008145938-1.pdf?src-supplier=IHS+Markit; ComponentLink2URL: https://datasheet.ciiva.com/2521/pyu-rc1206-51-rohs-l-4-2521020.pdf?src-supplier=Digikey; ComponentLink2Description: https://datasheet.ciiva.com/2521/pyu-rc1206-51-rohs-l-4-2521020.pdf?src-supplier=Digikey; ComponentLink3URL: https://datasheet.ciiva.com/2521/pyu-rc1206-51-rohs-l-4-2521021.pdf?src-supplier=Digikey; ComponentLink3Description: https://datasheet.ciiva.com/2521/pyu-rc1206-51-rohs-l-4-2521021.pdf?src-supplier=Digikey; ComponentLink4URL: https://datasheet.ciiva.com/2521/pyu-rc1206-51-rohs-l-4-2521019.pdf?src-supplier=Digikey; ComponentLink4Description: https://datasheet.ciiva.com/2521/pyu-rc1206-51-rohs-l-4-2521019.pdf?src-supplier=Digikey; LCSC Part Number: C488845
R32 = AC0402FR-0710KL: RES SMD 10K OHM 1% 1/16W 0402; Manufacturer: Yageo; Additional Feature: LASER TRIMMABLE; Power: 62.5mW; Rated Temperature: 70°C; Value: 10kR; Working Voltage: 50V; Temperature Coefficient (ppm/Cel): 100; Package Height: 0.32mm; Package Length: 1mm; Package Width: 0.5mm; Reference Standard: AEC-Q200; Supplier: Digikey; Supplier Part Number: YAG3436CT-ND; Manufacturer Part Number: AC0402FR-0710KL; RoHS: Yes; Category: Chip SMD Resistors; Stock: 269638; Pricing: 1=0,1, 10=0,009, 100=0,0082, 1000=0,00612, 2500=0,0051, 5000=0,00407 (USD); Mounting Technology: Surface Mount; Pins: 2; Package Shape: Rectangular; Case/Package: 0402; Terminal Finish: Nickel; Min Operating Temperature: -55°C; Max Operating Temperature: 155°C; Tolerance: 1%; JESD-609 Code: e3; Resistor Type: FIXED RESISTOR; Construction: Chip; Packaging: Tape and Reel; Technology: METAL GLAZE/THICK FILM; Termination: Wraparound; Reach SVHC Compliant: Yes; RoHS Compliant: Yes; ComponentLink1URL: https://datasheet.ciiva.com:443/pdfs/VipMasterIC/IC/YAGO/YAGO-S-A0003597364/YAGO-S-A0003597364-1.pdf?src-supplier=IHS+Markit; ComponentLink1Description: https://datasheet.ciiva.com:443/pdfs/VipMasterIC/IC/YAGO/YAGO-S-A0003597364/YAGO-S-A0003597364-1.pdf?src-supplier=IHS+Markit; ComponentLink2URL: https://datasheet.ciiva.com/12656/pyu-ac-51-rohs-l-2-12656634.pdf?src-supplier=Mouser; ComponentLink2Description: https://datasheet.ciiva.com/12656/pyu-ac-51-rohs-l-2-12656634.pdf?src-supplier=Mouser; LCSC Part Number: C144807
R35 = AC0402FR-0782KL: RES SMD 82K OHM 1% 1/16W 0402; Manufacturer: Yageo; Additional Feature: LASER TRIMMABLE; Power: 62.5mW; Rated Temperature: 70°C; Value: 82kR; Working Voltage: 50V; Temperature Coefficient (ppm/Cel): 100; Package Height: 0.32mm; Package Length: 1mm; Package Width: 0.5mm; Reference Standard: AEC-Q200; Supplier: Digikey; Supplier Part Number: YAG5311CT-ND; Manufacturer Part Number: AC0402FR-0782KL; RoHS: Yes; Category: Chip SMD Resistors; Stock: 68666; Pricing: 1=0,1, 10=0,009, 100=0,0071, 1000=0,0051, 2500=0,00407 (USD); Mounting Technology: Surface Mount; Pins: 2; Package Shape: Rectangular; Case/Package: 0402; Terminal Finish: Nickel; Min Operating Temperature: -55°C; Max Operating Temperature: 155°C; Tolerance: 1%; JESD-609 Code: e3; Resistor Type: FIXED RESISTOR; Construction: Chip; Packaging: Tape and Reel; Technology: METAL GLAZE/THICK FILM; Termination: Wraparound; Reach SVHC Compliant: Yes; RoHS Compliant: Yes; ComponentLink1URL: https://datasheet.ciiva.com:443/pdfs/VipMasterIC/IC/YAGO/YAGO-S-A0003597364/YAGO-S-A0003597364-1.pdf?src-supplier=IHS+Markit; ComponentLink1Description: https://datasheet.ciiva.com:443/pdfs/VipMasterIC/IC/YAGO/YAGO-S-A0003597364/YAGO-S-A0003597364-1.pdf?src-supplier=IHS+Markit; ComponentLink2URL: http://www.yageo.com/NewPortal/yageodocoutput?fileName=/pdf/R-Chip/PYu-AC_51_RoHS_L_5.pdf&src-supplier=Digikey; ComponentLink2Description: http://www.yageo.com/NewPortal/yageodocoutput?fileName=/pdf/R-Chip/PYu-AC_51_RoHS_L_5.pdf&src-supplier=Digikey; ComponentLink3URL: https://www.yageo.com/upload/media/product/productsearch/datasheet/rchip/PYu-AC_51_RoHS_L_7.pdf?src-supplier=Digikey; ComponentLink3Description: https://www.yageo.com/upload/media/product/productsearch/datasheet/rchip/PYu-AC_51_RoHS_L_7.pdf?src-supplier=Digikey; ComponentLink4URL: http://www.yageo.com/NewPortal/yageodocoutput?fileName=/pdf/R-Chip/PYu-AC_51_RoHS_L_6.pdf&src-supplier=Digikey; ComponentLink4Description: http://www.yageo.com/NewPortal/yageodocoutput?fileName=/pdf/R-Chip/PYu-AC_51_RoHS_L_6.pdf&src-supplier=Digikey; ComponentLink5URL: https://datasheet.octopart.com/AC0402FR-0782KL-Yageo-datasheet-151884373.pdf?src-supplier=Future+Electronics; ComponentLink5Description: https://datasheet.octopart.com/AC0402FR-0782KL-Yageo-datasheet-151884373.pdf?src-supplier=Future+Electronics; ComponentLink6URL: http://www.yageo.com/documents/recent/PYu-AC_51_RoHS_L_2_revised.pdf?src-supplier=Future+Electronics; ComponentLink6Description: http://www.yageo.com/documents/recent/PYu-AC_51_RoHS_L_2_revised.pdf?src-supplier=Future+Electronics; LCSC Part Number: C144735
R36 = AC0402FR-07200KL: RES SMD 200K OHM 1% 1/16W 0402; Manufacturer: Yageo; Additional Feature: LASER TRIMMABLE; Power: 62.5mW; Rated Temperature: 70°C; Value: 200kR; Working Voltage: 50V; Temperature Coefficient (ppm/Cel): 100; Package Height: 0.32mm; Package Length: 1mm; Package Width: 0.5mm; Reference Standard: AEC-Q200; Supplier: Digikey; Supplier Part Number: YAG3452CT-ND; Manufacturer Part Number: AC0402FR-07200KL; RoHS: Yes; Category: Chip SMD Resistors; Stock: 236735; Pricing: 1=0,1, 10=0,005, 100=0,0047, 1000=0,00407 (USD); Mounting Technology: Surface Mount; Pins: 2; Package Shape: Rectangular; Case/Package: 0402; Terminal Finish: Nickel; Min Operating Temperature: -55°C; Max Operating Temperature: 155°C; Tolerance: 1%; JESD-609 Code: e3; Resistor Type: FIXED RESISTOR; Construction: Chip; Packaging: Tape and Reel; Technology: METAL GLAZE/THICK FILM; Termination: Wraparound; Reach SVHC Compliant: Yes; RoHS Compliant: Yes; ComponentLink1URL: https://datasheet.ciiva.com:443/pdfs/VipMasterIC/IC/YAGO/YAGO-S-A0003597364/YAGO-S-A0003597364-1.pdf?src-supplier=IHS+Markit; ComponentLink1Description: https://datasheet.ciiva.com:443/pdfs/VipMasterIC/IC/YAGO/YAGO-S-A0003597364/YAGO-S-A0003597364-1.pdf?src-supplier=IHS+Markit; ComponentLink2URL: http://www.mouser.com/ds/2/447/yageodocoutput-1111992.pdf?src-supplier=Mouser; ComponentLink2Description: http://www.mouser.com/ds/2/447/yageodocoutput-1111992.pdf?src-supplier=Mouser; ComponentLink3URL: https://datasheet.octopart.com/AC0402FR-07200KL-Yageo-datasheet-178509465.pdf?src-supplier=Farnell; ComponentLink3Description: https://datasheet.octopart.com/AC0402FR-07200KL-Yageo-datasheet-178509465.pdf?src-supplier=Farnell; ComponentLink4URL: https://datasheet.octopart.com/AC0402FR-07200KL-Yageo-datasheet-178509465.pdf?src-supplier=Element14; ComponentLink4Description: https://datasheet.octopart.com/AC0402FR-07200KL-Yageo-datasheet-178509465.pdf?src-supplier=Element14; ComponentLink5URL: https://datasheet.octopart.com/AC0402FR-07200KL-Yageo-datasheet-178509465.pdf?src-supplier=Newark; ComponentLink5Description: https://datasheet.octopart.com/AC0402FR-07200KL-Yageo-datasheet-178509465.pdf?src-supplier=Newark; ComponentLink6URL: https://datasheet.octopart.com/AC0402FR-07200KL-Yageo-datasheet-166720450.pdf?src-supplier=Future+Electronics; ComponentLink6Description: https://datasheet.octopart.com/AC0402FR-07200KL-Yageo-datasheet-166720450.pdf?src-supplier=Future+Electronics; ComponentLink7URL: http://www.yageo.com/documents/recent/PYu-AC_51_RoHS_L_2_revised.pdf?src-supplier=Future+Electronics; ComponentLink7Description: http://www.yageo.com/documents/recent/PYu-AC_51_RoHS_L_2_revised.pdf?src-supplier=Future+Electronics; ComponentLink8URL: http://www.yageo.com/NewPortal/yageodocoutput?fileName=/pdf/R-Chip/PYu-AC_51_RoHS_L_6.pdf&src-supplier=Digikey; ComponentLink8Description: http://www.yageo.com/NewPortal/yageodocoutput?fileName=/pdf/R-Chip/PYu-AC_51_RoHS_L_6.pdf&src-supplier=Digikey; ComponentLink9URL: https://www.yageo.com/upload/media/product/productsearch/datasheet/rchip/PYu-AC_51_RoHS_L_7.pdf?src-supplier=Digikey; ComponentLink9Description: https://www.yageo.com/upload/media/product/productsearch/datasheet/rchip/PYu-AC_51_RoHS_L_7.pdf?src-supplier=Digikey; LCSC Part Number: C144785
R37 = AC0402FR-072ML: RES SMD 2M OHM 1% 1/16W 0402; Manufacturer: Yageo; Additional Feature: LASER TRIMMABLE; Power: 62.5mW; Rated Temperature: 70°C; Value: 2MR; Working Voltage: 50V; Temperature Coefficient (ppm/Cel): 100; Package Height: 0.32mm; Package Length: 1mm; Package Width: 0.5mm; Reference Standard: AEC-Q200; Supplier: Digikey; Supplier Part Number: 13-AC0402FR-072MLDKR-ND; Manufacturer Part Number: AC0402FR-072ML; RoHS: Yes; Category: Chip SMD Resistors; Stock: 51928; Pricing: 1=0,1, 10=0,009, 100=0,0071, 1000=0,00612, 2500=0,0051, 5000=0,00407 (USD); Mounting Technology: Surface Mount; Pins: 2; Package Shape: Rectangular; Case/Package: 0402; Terminal Finish: Nickel; Min Operating Temperature: -55°C; Max Operating Temperature: 155°C; Tolerance: 1%; JESD-609 Code: e3; Resistor Type: FIXED RESISTOR; Construction: Chip; Packaging: Tape and Reel; Technology: METAL GLAZE/THICK FILM; Termination: Wraparound; Reach SVHC Compliant: Yes; RoHS Compliant: Yes; ComponentLink1URL: https://datasheet.ciiva.com:443/pdfs/VipMasterIC/IC/YAGO/YAGO-S-A0003597364/YAGO-S-A0003597364-1.pdf?src-supplier=IHS+Markit; ComponentLink1Description: https://datasheet.ciiva.com:443/pdfs/VipMasterIC/IC/YAGO/YAGO-S-A0003597364/YAGO-S-A0003597364-1.pdf?src-supplier=IHS+Markit; ComponentLink2URL: https://datasheet.octopart.com/AC0402FR-072ML-Yageo-datasheet-178509465.pdf?src-supplier=Newark; ComponentLink2Description: https://datasheet.octopart.com/AC0402FR-072ML-Yageo-datasheet-178509465.pdf?src-supplier=Newark; ComponentLink3URL: http://www.yageo.com/NewPortal/yageodocoutput?fileName=/pdf/R-Chip/PYu-AC_51_RoHS_L_6.pdf&src-supplier=Digikey; ComponentLink3Description: http://www.yageo.com/NewPortal/yageodocoutput?fileName=/pdf/R-Chip/PYu-AC_51_RoHS_L_6.pdf&src-supplier=Digikey; ComponentLink4URL: https://datasheet.octopart.com/AC0402FR-072ML-Yageo-datasheet-151884373.pdf?src-supplier=Future+Electronics; ComponentLink4Description: https://datasheet.octopart.com/AC0402FR-072ML-Yageo-datasheet-151884373.pdf?src-supplier=Future+Electronics; LCSC Part Number: C138293
R38 = AC0402JR-073ML: RES SMD 3M OHM 5% 1/16W 0402; Manufacturer: Yageo; Additional Feature: LASER TRIMMABLE; Power: 62.5mW; Rated Temperature: 70°C; Value: 3MR; Working Voltage: 50V; Temperature Coefficient (ppm/Cel): 100; Package Height: 0.32mm; Package Length: 1mm; Package Width: 0.5mm; Reference Standard: AEC-Q200; Supplier: Digikey; Supplier Part Number: 13-AC0402JR-073MLCT-ND; Manufacturer Part Number: AC0402JR-073ML; RoHS: Yes; Category: Chip SMD Resistors; Stock: 20000; Pricing: 1=0,1, 10=0,008, 50=0,0072, 100=0,0061, 500=0,0051, 1000=0,00408 (USD); Mounting Technology: Surface Mount; Pins: 2; Package Shape: Rectangular; Case/Package: 0402; Terminal Finish: Nickel; Min Operating Temperature: -55°C; Max Operating Temperature: 155°C; Tolerance: 5%; JESD-609 Code: e3; Resistor Type: FIXED RESISTOR; Construction: Chip; Packaging: Tape and Reel; Technology: METAL GLAZE/THICK FILM; Termination: Wraparound; Reach SVHC Compliant: Yes; RoHS Compliant: Yes; ComponentLink1URL: https://datasheet.ciiva.com:443/pdfs/VipMasterIC/IC/YAGO/YAGO-S-A0003597364/YAGO-S-A0003597364-1.pdf?src-supplier=IHS+Markit; ComponentLink1Description: https://datasheet.ciiva.com:443/pdfs/VipMasterIC/IC/YAGO/YAGO-S-A0003597364/YAGO-S-A0003597364-1.pdf?src-supplier=IHS+Markit; ComponentLink2URL: https://datasheet.ciiva.com/12576/pyu-ac-51-rohs-l-2-12576685.pdf?src-supplier=Mouser; ComponentLink2Description: https://datasheet.ciiva.com/12576/pyu-ac-51-rohs-l-2-12576685.pdf?src-supplier=Mouser; LCSC Part Number: C227371
U30 = TLV3691IDCKR: IC COMPARATOR 1 GEN PUR SC70-5; Manufacturer: Texas Instruments; Package Body Material: Plastic; Output Type: PUSH-PULL; Average Bias Current-Max (IIB): 20nA; Bias Current-Max (IIB) @25C: 100pA; Input Offset Voltage-Max: 22mV; Channels: 1; Package Equivalence Code: TSSOP5/6,.08; Power Supplies: 0.9/6.5V; Response Time-Nom: 40000ns; Max Supply Current: 200nA; Supply Voltage Limit-Max: 7V; Qualification Status: Not Qualified; Supplier: Digikey; Supplier Part Number: 296-37910-1-ND; Manufacturer Part Number: TLV3691IDCKR; RoHS: Yes; Category: Amplifiers - Op Amps, Buffer, Instrumentation; Stock: 71451; Pricing: 1=1,1, 10=0,796, 25=0,7192, 100=0,6347, 250=0,59452, 500=0,57026, 1000=0,5503 (USD); Case/Package: TSSOP; Pins: 5; Package Shape: Rectangular; Terminal Finish: Nickel; Min Operating Temperature: -40°C; Max Operating Temperature: 125°C; JESD-609 Code: e4; Amplifier Type: COMPARATOR; JESD-30 Code: R-PDSO-G5; Moisture Sensitivity Level: 2; Package Style: SMALL OUTLINE, THIN PROFILE, SHRINK PITCHMeter; Peak Reflow Temperature (Cel): 260°C; Surface Mount: Yes; Terminal Form: Gull Wing; Terminal Position: DUAL; Length: 2mm; Width: 1.25mm; Height - Seated (Max): 1.1mm; Terminal Pitch: 0.65mm; Temperature Grade: AUTOMOTIVE; Reach SVHC Compliant: Yes; RoHS Compliant: Yes; ComponentLink1URL: https://www.ti.com:443/lit/ds/symlink/tlv3691.pdf?src-supplier=IHS+Markit; ComponentLink1Description: https://www.ti.com:443/lit/ds/symlink/tlv3691.pdf?src-supplier=IHS+Markit; ComponentLink2URL: http://components.arrow.com/part/dataview/63066199S705887N7713?src-supplier=Arrow+Electronics; ComponentLink2Description: http://components.arrow.com/part/dataview/63066199S705887N7713?src-supplier=Arrow+Electronics; ComponentLink3URL: http://www.ti.com/lit/ds/symlink/tlv3691.pdf?src-supplier=Digikey; ComponentLink3Description: http://www.ti.com/lit/ds/symlink/tlv3691.pdf?src-supplier=Digikey; ComponentLink4URL: http://www.ti.com/lit/ds/symlink/tlv3691.pdf?src-supplier=Farnell; ComponentLink4Description: http://www.ti.com/lit/ds/symlink/tlv3691.pdf?src-supplier=Farnell; ComponentLink5URL: http://www.ti.com/lit/ds/symlink/tlv3691.pdf?src-supplier=Avnet; ComponentLink5Description: http://www.ti.com/lit/ds/symlink/tlv3691.pdf?src-supplier=Avnet; ComponentLink6URL: http://www.ti.com/lit/gpn/tlv3691?src-supplier=Mouser; ComponentLink6Description: http://www.ti.com/lit/gpn/tlv3691?src-supplier=Mouser; LCSC Part Number: C180352